# EAGLE design dlms_v1 (EAGLE 9.6.2)
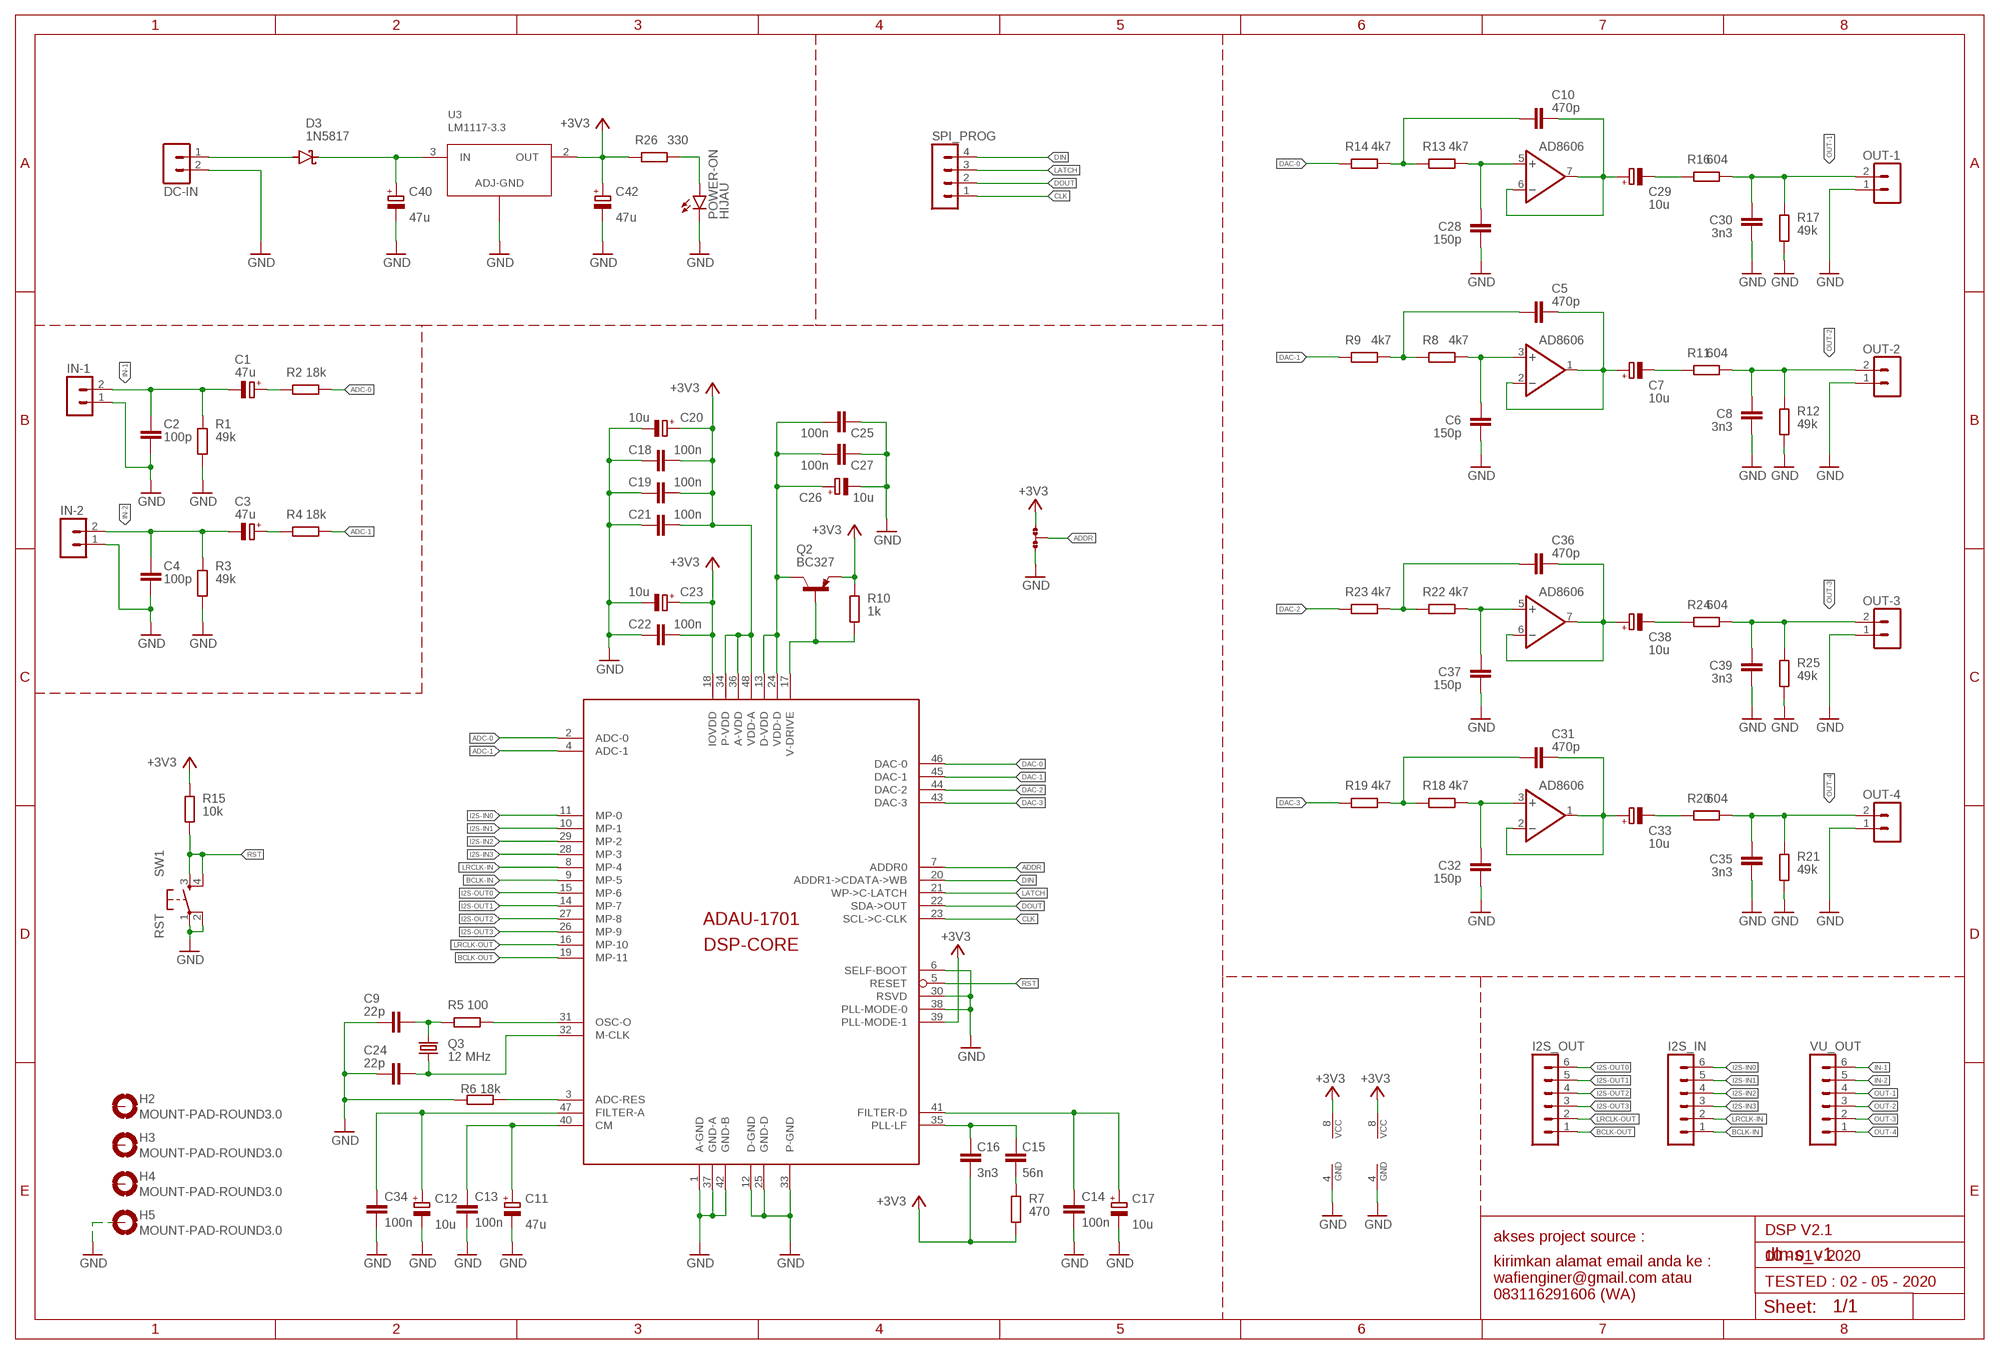
[diagram p0: schematic, sheet 1]

## Parts
ADDR  0R-JUMPA  [A0R-JMP]
C1  47u  C10UF  [E2,5-5]
C2  100p  C-STD  [C050-024X044]
C3  47u  C10UF  [E2,5-5]
C4  100p  C-STD  [C050-024X044]
C5  470p  C-STD  [C050-024X044]
C6  150p  C-STD  [C050-024X044]
C7  10u  C10UF  [E2,5-5]
C8  3n3  C-STD  [C050-024X044]
C9  22p  CAP  [0805]
C10  470p  C-STD  [C050-024X044]
C11  47u  C10UF  [E2,5-5]
C12  10u  C10UF  [E2,5-5]
C13  100n  CAP  [0805]
C14  100n  CAP  [0805]
C15  56n  C-STD  [C050-024X044]
C16  3n3  C-STD  [C050-024X044]
C17  10u  C10UF  [E2,5-5]
C18  100n  CAP  [0805]
C19  100n  CAP  [0805]
C20  10u  C10UF  [E2,5-5]
C21  100n  CAP  [0805]
C22  100n  CAP  [0805]
C23  10u  C10UF  [E2,5-5]
C24  22p  CAP  [0805]
C25  100n  CAP  [0805]
C26  10u  C10UF  [E2,5-5]
C27  100n  CAP  [0805]
C28  150p  C-STD  [C050-024X044]
C29  10u  C10UF  [E2,5-5]
C30  3n3  C-STD  [C050-024X044]
C31  470p  C-STD  [C050-024X044]
C32  150p  C-STD  [C050-024X044]
C33  10u  C10UF  [E2,5-5]
C34  100n  CAP  [0805]
C35  3n3  C-STD  [C050-024X044]
C36  470p  C-STD  [C050-024X044]
C37  150p  C-STD  [C050-024X044]
C38  10u  C10UF  [E2,5-5]
C39  3n3  C-STD  [C050-024X044]
C40  47u  C10UF  [E2,5-5]
C42  47u  C10UF  [E2,5-5]
D3  1N5817  [DO35Z7]
DC-IN  MOLEX-2  [6410-02]
H2  MOUNT-PAD-ROUND3.0  [3,0-PAD]
H3  MOUNT-PAD-ROUND3.0  [3,0-PAD]
H4  MOUNT-PAD-ROUND3.0  [3,0-PAD]
H5  MOUNT-PAD-ROUND3.0  [3,0-PAD]
I2S_IN  MOLEX-6  [6410-06]
I2S_OUT  MOLEX-6  [6410-06]
IC1  AD8606  [SOP8]
IC2  AD8606  [SOP8]
IN-1  MOLEX-2  [6410-02]
IN-2  MOLEX-2  [6410-02]
OUT-1  MOLEX-2  [6410-02]
OUT-2  MOLEX-2  [6410-02]
OUT-3  MOLEX-2  [6410-02]
OUT-4  MOLEX-2  [6410-02]
POWER-ON  HIJAU  LED3MM  [LED3MM]
Q2  BC327  [TO92-EBC]
Q3  12 MHz  CRYSTALHC49UP  [HC49UP]
R1  49k  R025  [0204/7]
R2  18k  R025  [0204/7]
R3  49k  R025  [0204/7]
R4  18k  R025  [0204/7]
R5  100  R025  [0204/7]
R6  18k  R025  [0204/7]
R7  470  R025  [0204/7]
R8  4k7  R025  [0204/7]
R9  4k7  R025  [0204/7]
R10  1k  R025  [0204/7]
R11  604  R025  [0204/7]
R12  49k  R025  [0204/7]
R13  4k7  R025  [0204/7]
R14  4k7  R025  [0204/7]
R15  10k  R025  [0204/7]
R16  604  R025  [0204/7]
R17  49k  R025  [0204/7]
R18  4k7  R025  [0204/7]
R19  4k7  R025  [0204/7]
R20  604  R025  [0204/7]
R21  49k  R025  [0204/7]
R22  4k7  R025  [0204/7]
R23  4k7  R025  [0204/7]
R24  604  R025  [0204/7]
R25  49k  R025  [0204/7]
R26  330  R025  [0204/7]
RST  SW1  SW  [B3F-10XX]
SPI_PROG  MOLEX-4  [6410-04]
U1  ADAU-1701  [LQFP-48]
U3  LM1117-3.3  [TO220H]
VU_OUT  MOLEX-6  [6410-06]

## Nets
+3V3: ADDR.1 C16.2 C18.P$1 C19.P$1 C20.+ C21.P$1 C22.P$1 C23.+ C42.+ IC1.8(VCC) IC2.8(VCC) Q2.E R7.1 R10.2 R15.2 R26.1 U1.18(IOVDD) U1.34(P-VDD) U1.36(A-VDD) U1.39(PLL-MODE-1) U1.48(VDD-A) U3.2(OUT)
ADC-0: R2.2 U1.2(ADC-0)
ADC-1: R4.2 U1.4(ADC-1)
ADDR: ADDR.2 U1.7(ADDR0)
BCLK-IN: I2S_IN.1 U1.9(MP-5)
BCLK-OUT: I2S_OUT.1 U1.19(MP-11)
CLK: SPI_PROG.1 U1.23(SCL->C-CLK)
CM: C11.+ C13.P$1 U1.40(CM)
DAC-0: R14.1 U1.46(DAC-0)
DAC-1: R9.1 U1.45(DAC-1)
DAC-2: R23.1 U1.44(DAC-2)
DAC-3: R19.1 U1.43(DAC-3)
DIN: SPI_PROG.4 U1.20(ADDR1->CDATA->WB)
DOUT: SPI_PROG.2 U1.22(SDA->OUT)
DVDD: C25.P$1 C26.+ C27.P$1 Q2.C U1.13(D-VDD) U1.24(VDD-D)
FIL-A: C12.+ C34.P$1 U1.47(FILTER-A)
FIL-D: C14.P$1 C17.+ U1.41(FILTER-D)
GND: ADDR.3 C2.2 C4.2 C6.1 C8.2 C9.P$2 C11.- C12.- C13.P$2 C14.P$2 C17.- C18.P$2 C19.P$2 C20.- C21.P$2 C22.P$2 C23.- C24.P$2 C25.P$2 C26.- C27.P$2 C28.1 C30.2 C32.1 C34.P$2 C35.2 C37.1 C39.2 C40.- C42.- DC-IN.2 H5.B3,0(MOUNT) IC1.4(GND) IC2.4(GND) IN-1.1 IN-2.1 OUT-1.1 OUT-2.1 OUT-3.1 OUT-4.1 POWER-ON.K(C) R1.1 R3.1 R6.1 R12.1 R17.1 R21.1 R25.1 RST.1(P) RST.2(P1) U1.1(A-GND) U1.6(SELF-BOOT) U1.12(D-GND) U1.25(GND-D) U1.30(RSVD) U1.33(P-GND) U1.37(GND-A) U1.38(PLL-MODE-0) U1.42(GND-B) U3.1(GND)
I2S-IN0: I2S_IN.6 U1.11(MP-0)
I2S-IN1: I2S_IN.5 U1.10(MP-1)
I2S-IN2: I2S_IN.4 U1.29(MP-2)
I2S-IN3: I2S_IN.3 U1.28(MP-3)
I2S-OUT0: I2S_OUT.6 U1.15(MP-6)
I2S-OUT1: I2S_OUT.5 U1.14(MP-7)
I2S-OUT2: I2S_OUT.4 U1.27(MP-8)
I2S-OUT3: I2S_OUT.3 U1.26(MP-9)
IN-1: C1.- C2.1 IN-1.2 R1.2 VU_OUT.6
IN-2: C3.- C4.1 IN-2.2 R3.2 VU_OUT.5
LATCH: SPI_PROG.3 U1.21(WP->C-LATCH)
LRCLK-IN: I2S_IN.2 U1.8(MP-4)
LRCLK-OUT: I2S_OUT.2 U1.16(MP-10)
N$2: C1.+ R2.1
N$4: C3.+ R4.1
N$5: C5.1 R8.1 R9.2
N$6: C6.2 IC1.3(+IN) R8.2
N$7: C5.2 C7.+ IC1.1(OUT) IC1.2(-IN)
N$8: C7.- R11.1
N$10: C10.1 R13.1 R14.2
N$11: C9.P$1 Q3.2 R5.1
N$12: C24.P$1 Q3.1 U1.32(M-CLK)
N$13: R5.2 U1.31(OSC-O)
N$14: C28.2 IC1.5(+IN) R13.2
N$15: C10.2 C29.+ IC1.6(-IN) IC1.7(OUT)
N$16: R6.2 U1.3(ADC-RES)
N$17: C29.- R16.1
N$18: C15.2 R7.2
N$20: C31.1 R18.1 R19.2
N$21: C32.2 IC2.3(+IN) R18.2
N$22: C31.2 C33.+ IC2.1(OUT) IC2.2(-IN)
N$23: C33.- R20.1
N$25: C36.1 R22.1 R23.2
N$26: C37.2 IC2.5(+IN) R22.2
N$27: C36.2 C38.+ IC2.6(-IN) IC2.7(OUT)
N$28: C38.- R24.1
N$42: C40.+ D3.C U3.3(IN)
N$43: POWER-ON.A R26.2
OUT-1: C30.1 OUT-1.2 R16.2 R17.2 VU_OUT.4
OUT-2: C8.1 OUT-2.2 R11.2 R12.2 VU_OUT.3
OUT-3: C39.1 OUT-3.2 R24.2 R25.2 VU_OUT.2
OUT-4: C35.1 OUT-4.2 R20.2 R21.2 VU_OUT.1
PLL-LF: C15.1 C16.1 U1.35(PLL-LF)
RST: R15.1 RST.3(S) RST.4(S1) U1.5(RESET)
VDRIVE: Q2.B R10.1 U1.17(V-DRIVE)
VIN: D3.A DC-IN.1
Unconnected: H2.B3,0(MOUNT) H3.B3,0(MOUNT) H4.B3,0(MOUNT)

## Notes on the sheet
- DSP V2.1
- akses project source :
- 10 - 01 - 2020
- TESTED : 02 - 05 - 2020
- kirimkan alamat email anda ke :
  wafienginer@gmail.com atau 
  083116291606 (WA)

## Library data of the parts
ADDR = jump-0r-smd:0R-JUMP: SMD 0R 0805 Jumper
C1 C3 C7 C11 C12 C17 C20 C23 C26 C29 C33 C38 C40 C42 = standart:C10UF
C2 C4-C6 C8 C10 C15 C16 C28 C30-C32 C35-C37 C39 = standart:C-STD
C9 C13 C14 C18 C19 C21 C22 C24 C25 C27 C34 = RL-smd:CAP
D3 = standart:1N5817
DC-IN IN-1 IN-2 OUT-1-OUT-4 = molex-header:MOLEX-2
H2-H5 = holes:MOUNT-PAD-ROUND: MOUNTING PAD, round
I2S_IN I2S_OUT VU_OUT = molex-header:MOLEX-6
IC1 IC2 = AD8606:AD8606
POWER-ON = komponenku:LED3MM
Q2 = transistor:BC327
Q3 = crystal:CRYSTAL: CRYSTAL; OC_FARNELL: unknown; OC_NEWARK: unknown
R1-R26 = standart:R025
RST = enc - sw:SW
SPI_PROG = molex-header:MOLEX-4
U1 = ADAU-1701:ADAU-1701
U3 = regulator:LM1117-3.3

## Board
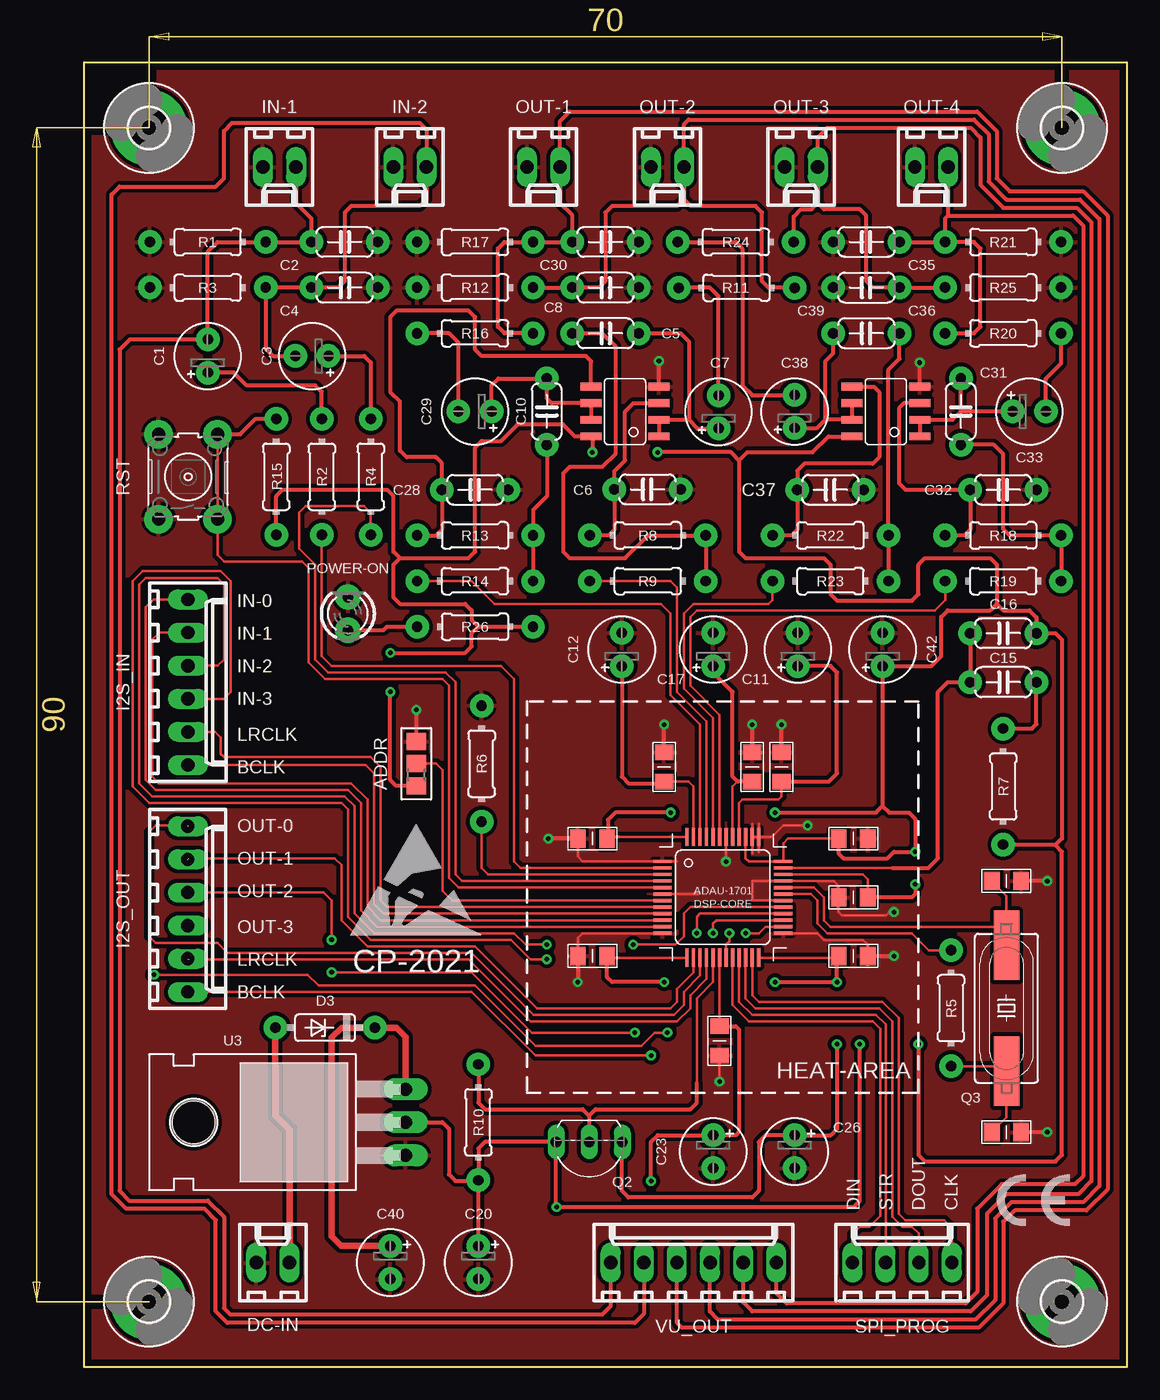
[diagram p1: board, top side]
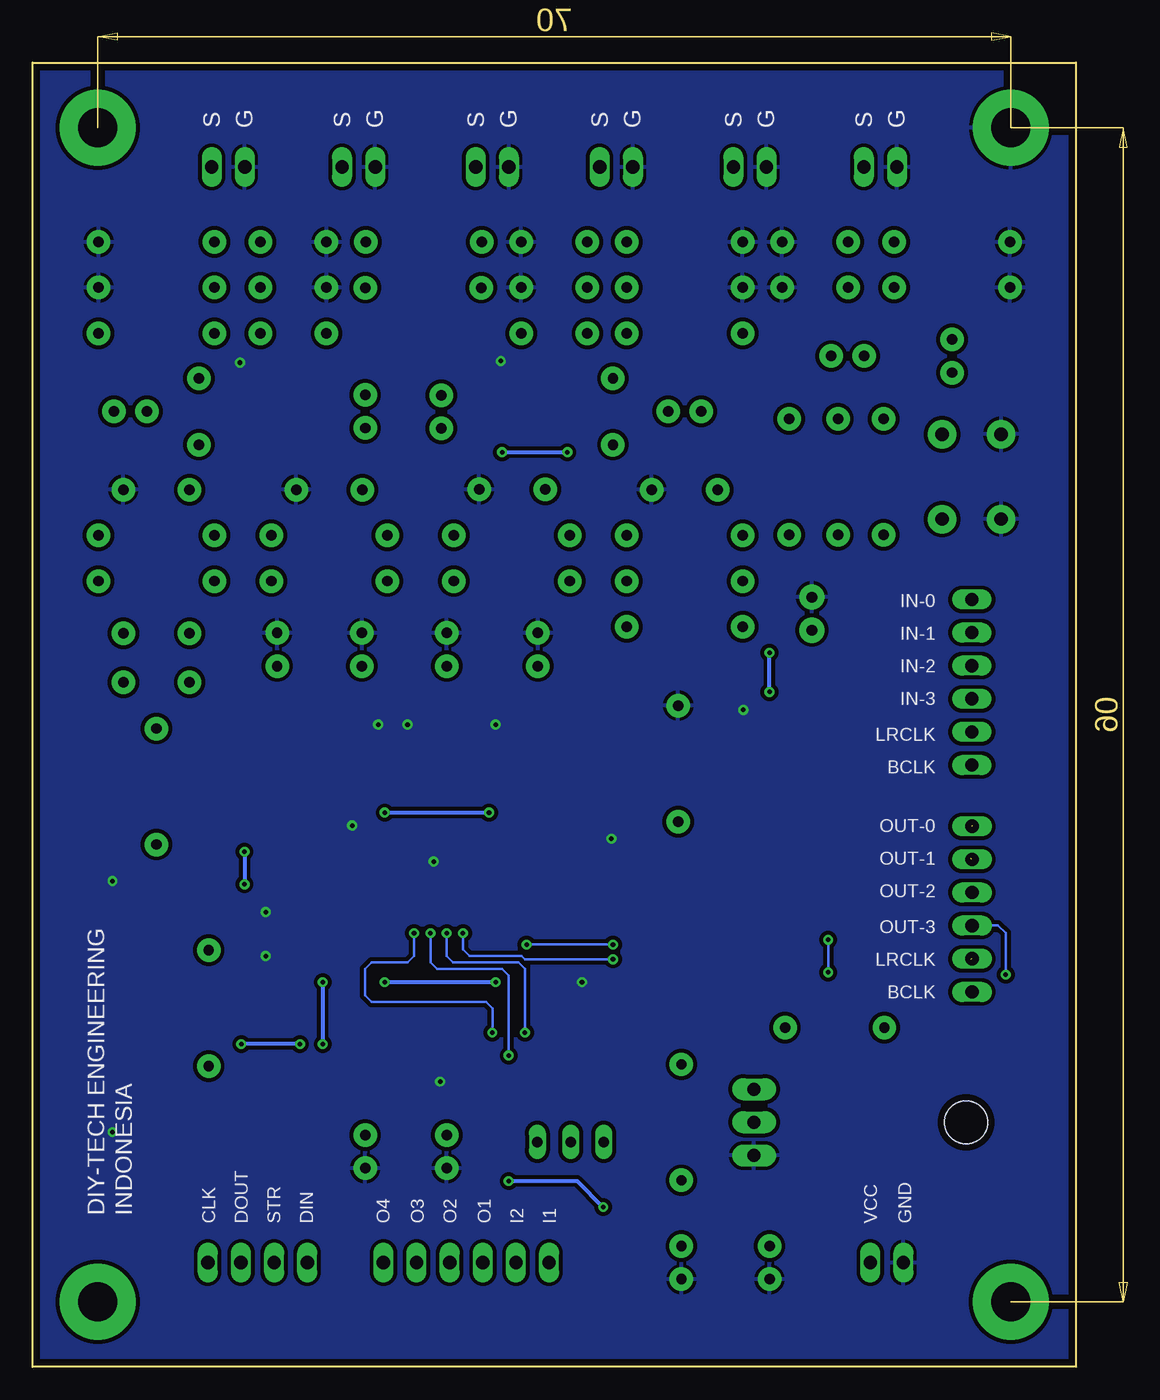
[diagram p2: board, bottom side, seen from below]

Size 80 x 100 mm. Coordinates in mm from the lower left corner, seen from the top.
Outline: 80,0 80,100 0,100 0,0 80,0
Copper layers (1*16): Top 0.035mm / dielectric 1.5mm / Bottom 0.035mm
Design rules "default *": minimum track width 0.2mm, minimum drill 0.35mm, track to track 0.2mm, track to pad 0.2mm, pad to pad 6mil, via to via 0.3mm, smd to smd 6mil, copper to edge 0.5mm, drill to drill 6mil, minimum pad ring 10mil, minimum via ring 8mil, stop-mask expansion 4mil, vias tented up to drill 0.35mm, thermal gap 10mil

### Footprints (pad centres in the part's own frame; a part is rotated, then mirrored left to right if it is on the bottom)
A0R-JMP = smd 1.5 x 1.3: 1 0,1.7; 2 0,0; 3 0,-1.7
E2,5-5 = drill 0.8 pad 1.8: + -1.27,0; - 1.27,0
C050-024X044 = drill 0.8 pad 1.8: 1 -2.54,0; 2 2.54,0
0805 = smd 1.2 x 1.4: P$1 -1.125,0; P$2 1.125,0
DO35Z7 = drill 0.8 pad 1.8: A 3.81,0; C -3.81,0
6410-02 = drill 1.016 long: 1 1.27,0; 2 -1.27,0
3,0-PAD = drill 3 pad 5.842: B3,0 0,0
6410-06 = drill 1.016 long: 1 6.35,0; 2 3.81,0; 3 1.27,0; 4 -1.27,0; 5 -3.81,0; 6 -6.35,0
SOP8 = smd 0.6 x 1.6: 1 -1.905,-2.6; 2 -0.635,-2.6; 3 0.635,-2.6; 4 1.905,-2.6; 5 1.905,2.6; 6 0.635,2.6; 7 -0.635,2.6; 8 -1.905,2.6
LED3MM = drill 0.813 pad 1.93: A -1.27,0; K 1.27,0
TO92-EBC = drill 0.813 long: B 0,0; C -2.54,0; E 2.54,0
HC49UP = smd 5.334 x 1.93: 1 -4.826,0; 2 4.826,0
0204/7 = drill 0.8 pad 1.8: 1 -4.445,0; 2 4.445,0
B3F-10XX = drill 1.016 pad 2.184: 1 -3.251,2.261; 2 3.251,2.261; 3 -3.251,-2.261; 4 3.251,-2.261
6410-04 = drill 1.016 long: 1 3.81,0; 2 1.27,0; 3 -1.27,0; 4 -3.81,0
LQFP-48 = smd 1.4 x 0.25: 1 -4.625,2.75; 2 -4.625,2.25; 3 -4.625,1.75; 4 -4.625,1.25; 5 -4.625,0.75; 6 -4.625,0.25; 7 -4.625,-0.25; 8 -4.625,-0.75; 9 -4.625,-1.25; 10 -4.625,-1.75; 11 -4.625,-2.25; 12 -4.625,-2.75; 25 4.625,-2.75; 26 4.625,-2.25; 27 4.625,-1.75; 28 4.625,-1.25; 29 4.625,-0.75; 30 4.625,-0.25; 31 4.625,0.25; 32 4.625,0.75; 33 4.625,1.25; 34 4.625,1.75; 35 4.625,2.25; 36 4.625,2.75 | smd 0.25 x 1.4: 13 -2.75,-4.625; 14 -2.25,-4.625; 15 -1.75,-4.625; 16 -1.25,-4.625; 17 -0.75,-4.625; 18 -0.25,-4.625; 19 0.25,-4.625; 20 0.75,-4.625; 21 1.25,-4.625; 22 1.75,-4.625; 23 2.25,-4.625; 24 2.75,-4.625; 37 2.75,4.625; 38 2.25,4.625; 39 1.75,4.625; 40 1.25,4.625; 41 0.75,4.625; 42 0.25,4.625; 43 -0.25,4.625; 44 -0.75,4.625; 45 -1.25,4.625; 46 -1.75,4.625; 47 -2.25,4.625; 48 -2.75,4.625
TO220H = drill 1 pad 1.7 long: 1 -2.54,-11.43; 2 0,-11.43; 3 2.54,-11.43 | hole 3.302: 0,4.826

### Placement (x,y rotation side)
ADDR  25.5,46.25 180 top
C1  9.5,77.5 90 top
C2  20,86.25 0 top
C3  17.5,77.5 180 top
C4  20,82.75 0 top
C5  40,79.25 0 top
C6  43.22,67.28 180 top
C7  48.67,73.22 90 top
C8  40,82.75 0 top
C9  70.75,18 0 top
C10  35.5,73.25 90 top
C11  54.75,55 90 top
C12  41.25,55 90 top
C13  53.5,46 90 top
C14  51.25,46 90 top
C15  70.5,52.5 0 top
C16  70.5,56.25 0 top
C17  48.25,55 90 top
C18  39,40.5 180 top
C19  59,40.5 0 top
C20  30.25,8 270 top
C21  59,36 180 top
C22  48.75,25 270 top
C23  48.25,16.5 270 top
C24  70.75,37.25 0 top
C25  59,31.5 0 top
C26  54.5,16.5 270 top
C27  39,31.5 180 top
C28  30,67.25 180 top
C29  30,73.25 180 top
C30  40,86.25 0 top
C31  67.25,73.25 90 top
C32  70.5,67.25 180 top
C33  72.5,73.25 0 top
C34  44.5,46 90 top
C35  60,86.25 180 top
C36  60,79.25 180 top
C37  57.25,67.25 180 top
C38  54.5,73.25 90 top
C39  60,82.75 180 top
C40  23.5,8 270 top
C42  61.25,55 90 top
D3  18.5,26 180 top
DC-IN  14.5,8 0 top
H2  75,5 90 top
H3  5,5 90 top
H4  75,95 90 top
H5  5,95 90 top
I2S_IN  7.98,52.49 270 top
I2S_OUT  7.97,35.1 270 top
IC1  41.5,73.25 90 top
IC2  61.5,73.25 90 top
IN-1  15,92 180 top
IN-2  25,92 180 top
OUT-1  35.25,92 180 top
OUT-2  44.75,92 180 top
OUT-3  55,92 180 top
OUT-4  65,92 180 top
POWER-ON  20.25,57.75 90 top
Q2  38.75,17.25 180 top
Q3  [HC49UP]  70.75,27.5 270 top
R1  9.5,86.25 0 top
R2  18.25,68.25 270 top
R3  9.5,82.75 0 top
R4  22,68.25 270 top
R5  66.5,27.5 90 top
R6  30.5,46.25 270 top
R7  70.5,44.5 90 top
R8  43.25,63.75 180 top
R9  43.25,60.25 0 top
R10  30.25,18.75 270 top
R11  50.05,82.74 0 top
R12  30,82.75 0 top
R13  30,63.75 180 top
R14  30,60.25 0 top
R15  14.75,68.25 270 top
R16  30,79.25 0 top
R17  30,86.25 0 top
R18  70.5,63.75 180 top
R19  70.5,60.25 0 top
R20  70.5,79.25 180 top
R21  70.5,86.25 180 top
R22  57.25,63.75 180 top
R23  57.25,60.25 0 top
R24  50,86.25 0 top
R25  70.5,82.75 180 top
R26  30,56.75 180 top
RST  8,68.25 90 top
SPI_PROG  62.75,8 0 top
U1  49,36 0 top
U3  13.25,18.75 90 top
U$2  [CE-4MM]  70,10.75 0 top
U$3  [ESD_10.00]  20.38,33 0 top
VU_OUT  46.75,8 0 top

### Tracks (layer width: path | path; a pad name or v marks a point on that pad's centre or on a via)
+3V3  (via drill 0.35, 0.35 pad 0.6)
  Top 0.2: U1.48 40.25,40.62 40.19,40.56 C18.P$1 | C19.P$1 54,40.5 53.62,40.12 U1.36 51,38.75 50.75,39 U1.39 | U1.18 C22.P$1 | U1.34 59.75,37.75 60.12,37.38 C21.P$1 60.25,36.12
  Top 0.3: 61.25,43 C42.+ 64.98,53.73 65.75,54.5 65.75,57.5 66.25,58 69.5,58 70,58.5 | 61.25,43 60.75,42.5 v53,42.5 | v45,42.5 40.75,42.5 40.19,41.94 40.19,40.56 | R10.2 30.25,16.75 30.75,17.25 Q2.E 36.21,12.29 v36.25,12.25 59,12.25 59.5,12.75 v59.5,24.75 | C22.P$1 50,26.12 50.25,25.88 50.25,18.02 50,17.77 C23.+ 44.02,17.77 43.5,17.25 v43.5,14.25 | C20.+ R10.2 | U3.2 27.5,18.75 28,18.25 28,14.75 28.5,14.25 30.2,14.25 R10.2 | R15.2 14.75,66.75 15.25,67.25 23.25,67.25 23.75,66.75 23.75,62.5 24.25,62 | v39,70.12 39,71.25 IC1.8 37.66,71.34 36.75,72.25 33.25,72.25 32,71 30.5,71 30,70.5 30,62.5 29.5,62 24.25,62 | IC2.8 57.09,71.34 55.88,70.12 50.88,70.12 50.25,69.5 | 61.25,43 61.75,42.5 63.25,42.5 63.75,42 v63.75,39.5 62.12,39.5 61.62,39 58.25,39 57.88,39.38 C19.P$1 | v63.75,37 63.75,36.25 63.5,36 60.38,36 60.25,36.12 | 74.5,40 75,40.5 75,55.75 74.5,56.25 C16.2 73.04,57.46 72.5,58 70.5,58 70,58.5 | 74.5,40 70.56,40 R7.1 | 74.5,40 75,39.5 75,16.25 74.5,15.75 64.5,15.75 64,16.25 v64,24.75 | ADDR.1 23.95,44.55 23.5,45 v23.5,51.75 | v23.5,54.75 29.25,54.75 29.75,55.25 29.75,56.25 30.25,56.75 | 30.25,56.75 29.75,57.25 29.75,58 29.25,58.5 24.25,58.5 23.75,59 23.75,61.5 24.25,62 | 50.25,69.5 49.62,70.12 v44,70.12 | 50.25,69.5 50.25,62.5 50.75,62 56.75,62 57.25,61.5 57.25,59.25 57.75,58.75 63.5,58.75 64,59.25 64,61.5 64.5,62 69.5,62 70,61.5 70,58.5 | 30.25,56.75 R26.1
  Bottom 0.3: v53,42.5 v45,42.5 | v44,70.12 v39,70.12 | v63.75,39.5 v63.75,37 | v23.5,51.75 v23.5,54.75 | v59.5,24.75 v64,24.75 | v43.5,14.25 38.25,14.25 v36.25,12.25
ADC-0
  Top 0.2: U1.2 33.5,38.25 33,38.75 33,52.75 32,53.75 19,53.75 18.25,54.5 R2.2
ADC-1
  Top 0.2: U1.4 29,37.25 28.5,37.75 28.5,52.5 27.75,53.25 18.75,53.25 17.75,54.25 17.75,61.5 16.5,62.75 16.5,65.5 17,66 21.5,66 22,65.5 R4.2
ADDR
  Top 0.2: ADDR.2 27,46.25 27.5,45.75 27.5,36.5 28.25,35.75 U1.7
BCLK-IN
  Top 0.2: U1.9 23,34.75 22.25,35.5 22.25,45.5 21.61,46.14 I2S_IN.1
BCLK-OUT  (via drill 0.35)
  Top 0.2: v49.5,33.25 49.5,32.62 49.25,32.38 U1.19 | v43.5,23.88 34.62,23.88 29.75,28.75 I2S_OUT.1
  Bottom 0.2: v49.5,33.25 49.5,31 49,30.5 44,30.5 43.5,30 v43.5,23.88
CLK
  Top 0.2: U1.23 51.25,28.5 51.75,28 61.25,28 62.5,26.75 62.5,11.75 63,11.25 66,11.25 66.56,10.69 SPI_PROG.1
CM
  Top 0.2: U1.40 50.25,43.25 50.5,43.5 53.25,43.5 53.5,43.75 C13.P$1
  Top 0.3: C11.+ 54.77,53.75 57.25,53.75 57.75,53.25 57.75,45.5 57.12,44.88 C13.P$1
DAC-0
  Top 0.2: R14.1 29.75,60.25 31.5,58.5 44.25,58.5 45,57.75 45,51.5 47.25,49.25 U1.46
DAC-1
  Top 0.2: U1.45 47.75,49.5 45.5,51.75 45.5,59.75 45,60.25 R9.1
DAC-2
  Top 0.2: U1.44 48.25,49.75 46,52 46,57.75 46.75,58.5 52.5,58.5 52.8,58.8 R23.1
DAC-3
  Top 0.2: R19.1 66.06,58.8 65.25,58 47,58 46.5,57.5 46.5,52.25 48.75,50 U1.43
DIN
  Top 0.2: U1.20 49.75,27.75 51,26.5 60.5,26.5 61.08,25.92 61.08,11.58 60.25,10.75 59.5,10.75 58.94,10.19 SPI_PROG.4
DOUT
  Top 0.2: U1.22 50.75,28.25 51.5,27.5 61,27.5 62,26.5 62,11.5 62.75,10.75 63.5,10.75 64.02,10.23 SPI_PROG.2
DVDD  (via drill 0.35)
  Top 0.2: U1.13 40.25,31.38 C27.P$1 | C25.P$1 57.75,31.38 U1.24
  Top 0.3: v44.5,29.5 40.5,29.5 40.12,29.88 C27.P$1 | 57.75,31.38 v57.75,29.5 v53,29.5 | Q2.C 41.25,17.21 41.25,13.5 41.75,13 51.25,13 51.75,13.5 51.75,17.25 52.27,17.77 C26.+ 57.27,17.77 57.75,18.25 v57.75,24.75
  Bottom 0.3: v53,29.5 v44.5,29.5 | v57.75,29.5 v57.75,24.75
FIL-A
  Top 0.2: C34.P$1 46.38,44.88 46.75,44.5 U1.47
  Top 0.3: C34.P$1 44.38,44.75 41.75,44.75 41.25,45.25 C12.+
FIL-D
  Top 0.2: U1.41 49.75,44.5 50.12,44.88
  Top 0.3: C14.P$1 50.12,44.88 49.75,45.25 49.75,51.75 48.25,53.25 C17.+
GND  (via drill 0.35)
  Top 0.2: v62.12,34.88 61.75,34.88 61.5,34.62 58.12,34.62 57.88,34.88 C21.P$2 57.88,36.88 57.5,37.25 U1.33 51.25,37.25 51.25,35.75 U1.30 | C18.P$2 37.88,39.12 38.25,38.75 U1.1 45.5,38.75 | U1.12 38.25,33.25 37.88,32.88 C27.P$2 | C25.P$2 60.12,32.38 59.75,32.75 56.75,32.75 56.25,33.25 U1.25 | C22.P$2 v48.75,21.88 | U1.42 v49.25,38.75 | v55.5,41.5 53.62,41.5 52.75,40.62 U1.37 | U1.38 U1.37 | U1.38 51.25,41.62 | U1.37 51.75,41.62 | U1.38 51.25,39.38 | U1.37 51.75,39.5 | U1.6 47.12,36.25
  Top 0.3: C18.P$2 v35.62,40.5 | C34.P$2 v44.5,49.25 | C14.P$2 v51.25,49.25 | C13.P$2 v53.5,49.25 | C27.P$2 v37.88,29.5 | IC1.4 v44.1,77.12 | IC2.4 v64.1,77 | v73.88,18 C9.P$2 | v73.88,37.25 C24.P$2 | ADDR.3 v25.5,50.38 | C25.P$2 v62.12,31.5
  pour Bottom (isolate 0.3): 0,100 80,100 80,0 0,0
  pour Top (isolate 0.3): 0,100 80,100 80,0 0,0
I2S-IN0
  Top 0.2: U1.11 22.5,33.75 21.25,35 21.25,43.25 20.25,44.25 5.5,44.25 4.75,45 4.75,58.25 5.35,58.85 I2S_IN.6
I2S-IN1
  Top 0.2: U1.10 22.75,34.25 21.75,35.25 21.75,43.5 20.5,44.75 5.75,44.75 5.25,45.25 5.25,55.75 5.81,56.31 I2S_IN.5
I2S-IN2  (via drill 0.35)
  Top 0.2: v42.12,32.38 45.38,32.38 46,33 46,34.75 46.5,35.25 U1.29 | v35.5,32.38 33.88,32.38 33,33.25 22.25,33.25 20.75,34.75 20.75,43 20,43.75 5.25,43.75 4.25,44.75 4.25,60 4.75,60.5 10.25,60.5 10.75,60 10.75,54.25 10.26,53.76 I2S_IN.4
  Bottom 0.2: v42.12,32.38 v35.5,32.38
I2S-IN3  (via drill 0.35)
  Top 0.2: v35.5,31.25 34.25,31.25 32.75,32.75 22,32.75 20.25,34.5 20.25,42.75 19.75,43.25 5,43.25 3.75,44.5 3.75,60.25 4.5,61 10.5,61 11.25,60.25 11.25,51.75 10.72,51.22 I2S_IN.3 | U1.28 47.25,34.75 47,34.5 v47,33.25
  Bottom 0.2: v35.5,31.25 42.25,31.25 42.5,31.5 46.5,31.5 47,32 v47,33.25
I2S-OUT0  (1 unrouted)
  Top 0.2: U1.15 47.25,30 46,28.75 46,27.75 45.25,27 34.5,27 29.75,31.75 11,31.75 10.25,32.5 5.5,32.5 5,33 5,41 5.5,41.5 7.97,41.5
I2S-OUT1  (1 unrouted)
  Top 0.2: U1.14 46.75,30.25 45.5,29 45.5,28 45,27.5 34.75,27.5 30,32.25 21.75,32.25 19.75,34.25 19.75,38.5 19.25,39 8.06,39
I2S-OUT2  (via drill 0.35)
  Top 0.2: v19,32.75 19,35.75 18.38,36.37 I2S_OUT.4 | U1.27 48.5,34.25 48.25,34 v48.25,33.25 | v42.25,25.62 34.38,25.62 29.75,30.25 v19,30.25
  Bottom 0.2: v19,32.75 v19,30.25 | v48.25,33.25 48.25,31.5 47.75,31 42.75,31 42.25,30.5 v42.25,25.62
I2S-OUT3  (via drill 0.35)
  Top 0.2: U1.26 52.25,33.75 51.75,33.25 v50.75,33.25 | v5.38,30.07 17.18,30.07 18,29.25 30,29.25 34.62,24.62 42.75,24.62 43.75,25.62 v44.75,25.62
  Bottom 0.2: v50.75,33.25 50.75,31.5 51.25,31 54,31 54.5,30.5 54.5,28.5 54,28 45.25,28 44.75,27.5 v44.75,25.62 | v5.38,30.07 5.38,33.26 5.98,33.85 7.95,33.85 I2S_OUT.3
IN-1
  Top 0.3: 16.25,89.25 17.46,88.04 C2.1 R1.2 10.25,86.25 9.5,85.5 C1.- 3.52,78.77 2.75,78 2.75,13.5 3.5,12.75 9.5,12.75 10.75,11.5 10.75,4.5 11.25,4 39.75,4 40.4,4.65 VU_OUT.6 | 16.25,89.25 16.25,91.98 | IN-1.2 16.27,89.27 16.25,89.25
IN-2
  Top 0.3: C3.- 14.5,77.5 13.95,78.06 R3.2 C4.1 19.5,82.75 20,83.25 20,88.5 20.5,89 25.75,89 26.27,89.52 IN-2.2 26.27,94.86 25.75,95.38 11.38,95.38 10.75,94.75 10.75,91.12 10.12,90.5 2.75,90.5 2.12,89.88 2.12,13.25 3.25,12.12 9.25,12.12 10.12,11.25 10.12,4.25 11,3.38 42.25,3.38 42.94,4.07 VU_OUT.5
LATCH
  Top 0.2: U1.21 50.25,28 51.25,27 60.75,27 61.5,26.25 61.5,8.02 SPI_PROG.3
LRCLK-IN
  Top 0.2: U1.8 23.25,35.25 22.75,35.75 22.75,46 22,46.75 10.75,46.75 10.5,47 10.5,48.25 10.06,48.69 I2S_IN.2
LRCLK-OUT  (1 unrouted)
  Top 0.2: U1.16 47.75,29.75 46.5,28.5 46.5,27.5 45.5,26.5 34.25,26.5 29.5,31.25 8.06,31.25
N$2
  Top 0.3: R2.1 18.25,74.75 17.75,75.25 12.5,75.25 11.5,76.25 9.52,76.25 C1.+
N$4
  Top 0.3: C3.+ 21.5,77.5 22,77 R4.1
N$5
  Top 0.3: R9.2 R8.1 43.25,63.75 41.5,62 37.25,62 36.75,62.5 36.75,68.5 37.25,69 39.75,69 40.75,70 40.75,78.25 39.75,79.25 C5.1
N$6
  Top 0.3: R8.2 40.25,63.75 40.68,64.18 C6.2 40.68,68.68 41.5,69.5 41.5,73.25 42.13,73.89 IC1.3
N$7
  Top 0.3: IC1.1 IC1.2 46.38,72.61 | C7.+ 47.05,71.95 46.38,72.61 | C5.2 45.75,79.25 46.38,78.61 46.38,72.61
N$8
  Top 0.3: C7.- 48.67,82.08 48,82.75 45.62,82.75 R11.1
N$10
  Top 0.3: R14.2 R13.1 34.45,65.69 35.5,66.75 C10.1
N$11
  Top 0.2: R5.1 70.37,23.05 Q3.2 70.75,19.12 C9.P$1
N$12
  Top 0.2: 70.75,34.5 70.75,33.75 | 70.75,34.5 71,34.25 | Q3.1 70.75,33.75 | 70.75,34.5 70.75,36.12 C24.P$1 | U1.32 56,36.75 56.75,36 56.75,34.25 57.25,33.75 70.75,33.75
N$13
  Top 0.2: U1.31 55.75,36.25 56.25,35.75 56.25,34 57,33.25 63.5,33.25 64.81,31.95 R5.2
N$14
  Top 0.3: IC1.5 38.9,77.1 38.5,77.5 30.5,77.5 30,78 30,80.5 29.5,81 24,81 23.5,80.5 23.5,74.75 24.25,74 24.25,70.25 24.75,69.75 27,69.75 27.46,69.29 C28.2 27.5,67.21 27.5,64.25 27,63.75 R13.2
N$15
  Top 0.3: C10.2 35.63,75.66 | C29.+ 31.27,75.27 31.79,75.79 C10.2 | IC1.7 IC1.6 35.87,73.89 35.5,74.25 C10.2
N$16
  Top 0.2: R6.2 30.5,38.25 31,37.75 U1.3
N$17
  Top 0.3: C29.- 28.73,78.52 28,79.25 R16.1
N$18
  Top 0.3: R7.2 72.69,48.95 73.04,49.29 C15.2
N$20
  Top 0.3: R19.2 R18.1 71,63.75 70.5,64.25 70.5,70 69.79,70.71 C31.1
N$21
  Top 0.3: R18.2 67.5,63.75 67.96,64.21 C32.2 63,67.25 62.5,67.75 62.5,73.5 62.88,73.89 IC2.3
N$22
  Top 0.3: IC2.1 IC2.2 66.61,72.61 67.25,73.25 | 67.25,73.25 C31.2 | C33.+ 67.25,73.25
N$23
  Top 0.3: C33.- 73.77,75.77 74.94,76.94 R20.1
N$25
  Top 0.3: R23.2 R22.1 61.7,76.44 62.54,77.29 C36.1
N$26
  Top 0.3: R22.2 54.25,63.75 54.71,64.21 C37.2 54.71,68.71 55.25,69.25 60.5,69.25 61,69.75 61,74.75 60.59,75.16 IC2.5
N$27
  Top 0.3: IC2.6 IC2.7 56.87,72.61 | C38.+ 56.23,71.98 56.87,72.61 | 56.87,72.61 56.87,77.11 57.46,77.71 C36.2
N$28
  Top 0.3: R24.1 50,86.25 50.5,85.75 50.5,75.25 51.25,74.5 54.48,74.5 C38.-
N$42
  Top 0.5: C40.+ 19.73,9.27 19,10 19,25.25 19.75,26 D3.C 24,26 24.68,25.32 U3.3
N$43
  Top 0.3: POWER-ON.A 22.98,56.48 23.25,56.75 R26.2
OUT-1
  Top 0.3: R16.2 32.25,79.25 31.75,79.75 31.75,85.75 32.25,86.25 R17.2 C30.1 37.46,88.29 36.52,89.23 OUT-1.2 36.52,95.52 37.25,96.25 68.5,96.25 70,94.75 70,91.12 71,90.12 76.62,90.12 78.5,88.25 78.5,13.62 76.88,12 71.38,12 70.5,11.12 70.5,4.88 68.62,3 45.88,3 45.48,3.4 VU_OUT.4
OUT-2
  Top 0.3: R12.2 C8.1 39.5,82.75 40,83.25 40,88.5 40.5,89 45.5,89 46.02,89.52 | R11.2 52.51,82.74 52,83.25 52,88.5 51.5,89 46.54,89 46.02,89.52 | 46.02,89.52 OUT-2.2 46.02,95.27 46.38,95.62 68.25,95.62 69.38,94.5 69.38,90.88 70.75,89.5 76.38,89.5 77.88,88 77.88,13.88 76.62,12.62 71.12,12.62 69.88,11.38 69.88,5.12 68.38,3.62 48.62,3.62 48,4.25 48,7.98 VU_OUT.3
OUT-3
  Top 0.3: R25.2 C39.1 60.5,82.75 60,83.25 60,88.25 59.5,88.75 56.75,88.75 56.27,89.23 | R24.2 54.45,88.19 55,88.75 55.79,88.75 56.27,89.23 | 56.27,89.23 OUT-3.2 56.27,94.27 57,95 68,95 68.75,94.25 68.75,90.62 70.5,88.88 76.12,88.88 77.25,87.75 77.25,14.25 76.25,13.25 70.75,13.25 69.25,11.75 69.25,5.5 68,4.25 51.25,4.25 50.56,4.94 VU_OUT.2
OUT-4
  Top 0.3: C35.1 R21.2 | 66.27,88.27 66.06,88.06 R21.2 | R20.2 68.25,79.25 68.75,79.75 68.75,85.75 68.25,86.25 R21.2 | 66.27,88.27 75.86,88.27 76.62,87.5 76.62,14.62 76,14 70.38,14 68.5,12.12 68.5,5.75 67.62,4.88 53.88,4.88 53.1,5.65 VU_OUT.1 | OUT-4.2 66.27,88.27
PLL-LF
  Top 0.2: U1.35 62,38.25
  Top 0.3: C16.1 C15.1 66.25,52.5 65.5,51.75 65.5,39 64.75,38.25 62,38.25
RST
  Top 0.2: U1.5 28.75,36.75 28,37.5 28,52.25 27.5,52.75 18.5,52.75 17.25,54 17.25,61.25 16.75,61.75 10.75,61.75 10.26,62.24 RST.3 RST.4
  Top 0.3: RST.4 12,71.5 13.2,72.69 R15.1
VDRIVE
  Top 0.2: U1.17 48.25,29.5 47,28.25 47,21.75
  Top 0.3: R10.1 30.25,20.25 30.75,19.75 38.25,19.75 38.75,19.25 | 38.75,19.25 Q2.B | 38.75,19.25 39.25,19.75 46.5,19.75 47,20.25 47,21.75
VIN
  Top 0.5: D3.A 14.69,19.31 15.62,18.38 15.77,18.23 DC-IN.1

### Text on the board
tPlace: CP-2021
tNames: IN-0 | IN-1 | IN-2 | IN-3 | LRCLK | BCLK | OUT-0 | OUT-1 | OUT-2 | OUT-3 | LRCLK | BCLK | HEAT-AREA | DIN | STR | DOUT | CLK
bNames: G | S | G | S | G | S | G | S | G | S | G | S | IN-0 | IN-1 | IN-2 | IN-3 | LRCLK | BCLK | OUT-0 | OUT-1 | OUT-2 | OUT-3 | LRCLK | BCLK | INDONESIA | DIY-TECH ENGINEERING | GND | VCC | I1 | I2 | O1 | O2 | O3 | O4 | DIN | STR | DOUT | CLK